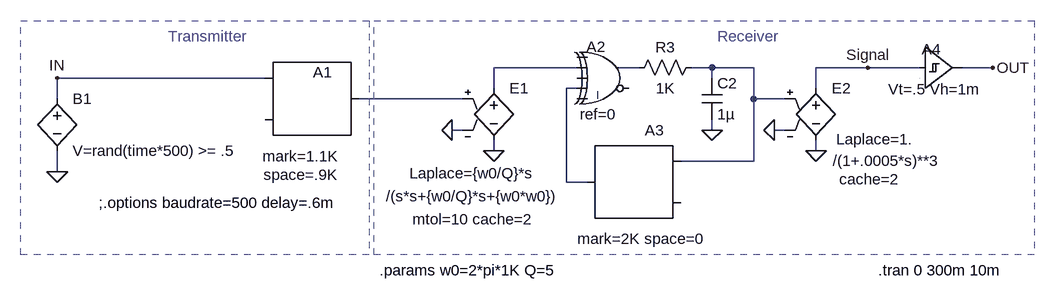
[diagram p0: schematic pll.asc]
pll.asc, the LTspice schematic file:
Version 4
SHEET 1 2148 1576
WIRE 640 912 512 912
WIRE 736 912 704 912
WIRE 848 912 816 912
WIRE 912 912 848 912
WIRE 1088 912 1008 912
WIRE 1168 912 1088 912
WIRE 1280 912 1232 912
WIRE 160 928 -160 928
WIRE 848 928 848 912
WIRE 512 944 512 912
WIRE 640 944 624 944
WIRE 1008 944 1008 912
WIRE -160 960 -160 928
WIRE 464 960 304 960
WIRE 912 960 912 912
WIRE 960 960 912 960
WIRE 464 1008 448 1008
WIRE 848 1008 848 992
WIRE 960 1008 944 1008
WIRE 512 1040 512 1024
WIRE 1008 1040 1008 1024
WIRE 912 1056 912 960
WIRE 912 1056 800 1056
WIRE -160 1072 -160 1040
WIRE 624 1088 624 944
WIRE 656 1088 624 1088
FLAG -160 1072 0
FLAG -160 928 IN
FLAG 848 1008 0
FLAG 944 1008 0
FLAG 1008 1040 0
FLAG 448 1008 0
FLAG 512 1040 0
FLAG 1280 912 OUT
FLAG 1088 912 Signal
SYMBOL SPECIALFUNCTIONS\\MODULATE 160 928 R0
WINDOW 0 74 -9 Left 0
WINDOW 3 55 105 Top 0
WINDOW 123 55 133 Top 0
SYMATTR InstName A1
SYMATTR Value mark=1.1K
SYMATTR Value2 space=.9K
SYMBOL RES 832 896 R90
WINDOW 0 0 56 VBottom 0
WINDOW 3 32 56 VTop 0
SYMATTR InstName R3
SYMATTR Value 1K
SYMBOL cap 832 928 R0
SYMATTR InstName C2
SYMATTR Value 1µ
SYMBOL SPECIALFUNCTIONS\\MODULATE 800 1056 M0
WINDOW 0 55 -48 Right 0
WINDOW 3 61 119 Center 0
SYMATTR InstName A3
SYMATTR Value mark=2K space=0
SYMBOL DIGITAL\\XOR 688 864 R0
WINDOW 0 -33 16 Left 0
WINDOW 3 -43 120 Left 0
SYMATTR InstName A2
SYMATTR Value ref=0
SYMBOL DIGITAL\\SCHMTBUF 1168 848 R0
WINDOW 0 3 36 Left 0
WINDOW 3 22 97 Center 0
SYMATTR InstName A4
SYMATTR Value Vt=.5 Vh=1m
SYMBOL E 1008 928 R0
WINDOW 3 31 94 Left 0
WINDOW 39 36 156 Left 0
WINDOW 123 26 127 Left 0
SYMATTR Value Laplace=1.
SYMATTR SpiceLine cache=2
SYMATTR Value2 /(1+.0005*s)**3
SYMATTR InstName E2
SYMBOL e 512 928 R0
WINDOW 3 -33 131 Top 0
WINDOW 39 -32 202 Top 0
WINDOW 123 -33 166 Top 0
SYMATTR Value Laplace={w0/Q}*s
SYMATTR SpiceLine mtol=10 cache=2
SYMATTR Value2 /(s*s+{w0/Q}*s+{w0*w0})
SYMATTR InstName E1
SYMBOL BV -160 944 R0
SYMATTR InstName B1
SYMATTR Value V=rand(time*500) >= .5
TEXT 1104 1224 Left 0 !.tran 0 300m 10m
TEXT 336 1224 Left 0 !.params w0=2*pi*1K Q=5
TEXT -96 1120 Left 0 !;.options baudrate=500 delay=.6m
TEXT 904 848 Top 0 ;Receiver
TEXT 72 848 Top 0 ;Transmitter
RECTANGLE Normal 320 1200 -216 840 2
RECTANGLE Normal 1344 1200 328 840 2

The netlist it stands for:
* pll.asc
A1 IN 0 0 0 0 0 N005 0 MODULATOR mark=1.1K space=.9K
R3 N003 N002 1K
C2 N003 0 1µ
A3 N003 0 0 0 0 0 N004 0 MODULATOR mark=2K space=0
A2 0 N001 0 N004 0 0 N002 0 XOR ref=0
A4 Signal 0 0 0 0 0 OUT 0 SCHMITT Vt=.5 Vh=1m
E2 Signal 0 N003 0 Laplace=1. /(1+.0005*s)**3 cache=2
E1 N001 0 N005 0 Laplace={w0/Q}*s /(s*s+{w0/Q}*s+{w0*w0}) mtol=10 cache=2
B1 IN 0 V=rand(time*500) >= .5
.tran 0 300m 10m
.params w0=2*pi*1K Q=5
;.options baudrate=500 delay=.6m
* Receiver
* Transmitter
.backanno
.end